# Altium project FMC_Delay_1ns_4Cha.PrjPcb (part 2 of 2)

## Sheet TDC.SchDoc: TDC
size 420 x 297 mm; CheckedBy: -; CompanyName: CERN; DrawnBy: GK; Organization: CERN; Address1: European Organization for Nuclear Research; Address2: CH-1211 Genève 23 - Switzerland; Revision: -; SheetNumber: 7; SheetTotal: 9; EDA_Number: EDA-XXXXX-VX-X; Projet: FMC Delay 1ns 4cha; ModifiedBy: -; CreateDate: XX/XX/XXXX; CheckedDate: -; Title2: Title2; DivGrp: BE-CO; Designer: GK; ModifiedDate: -
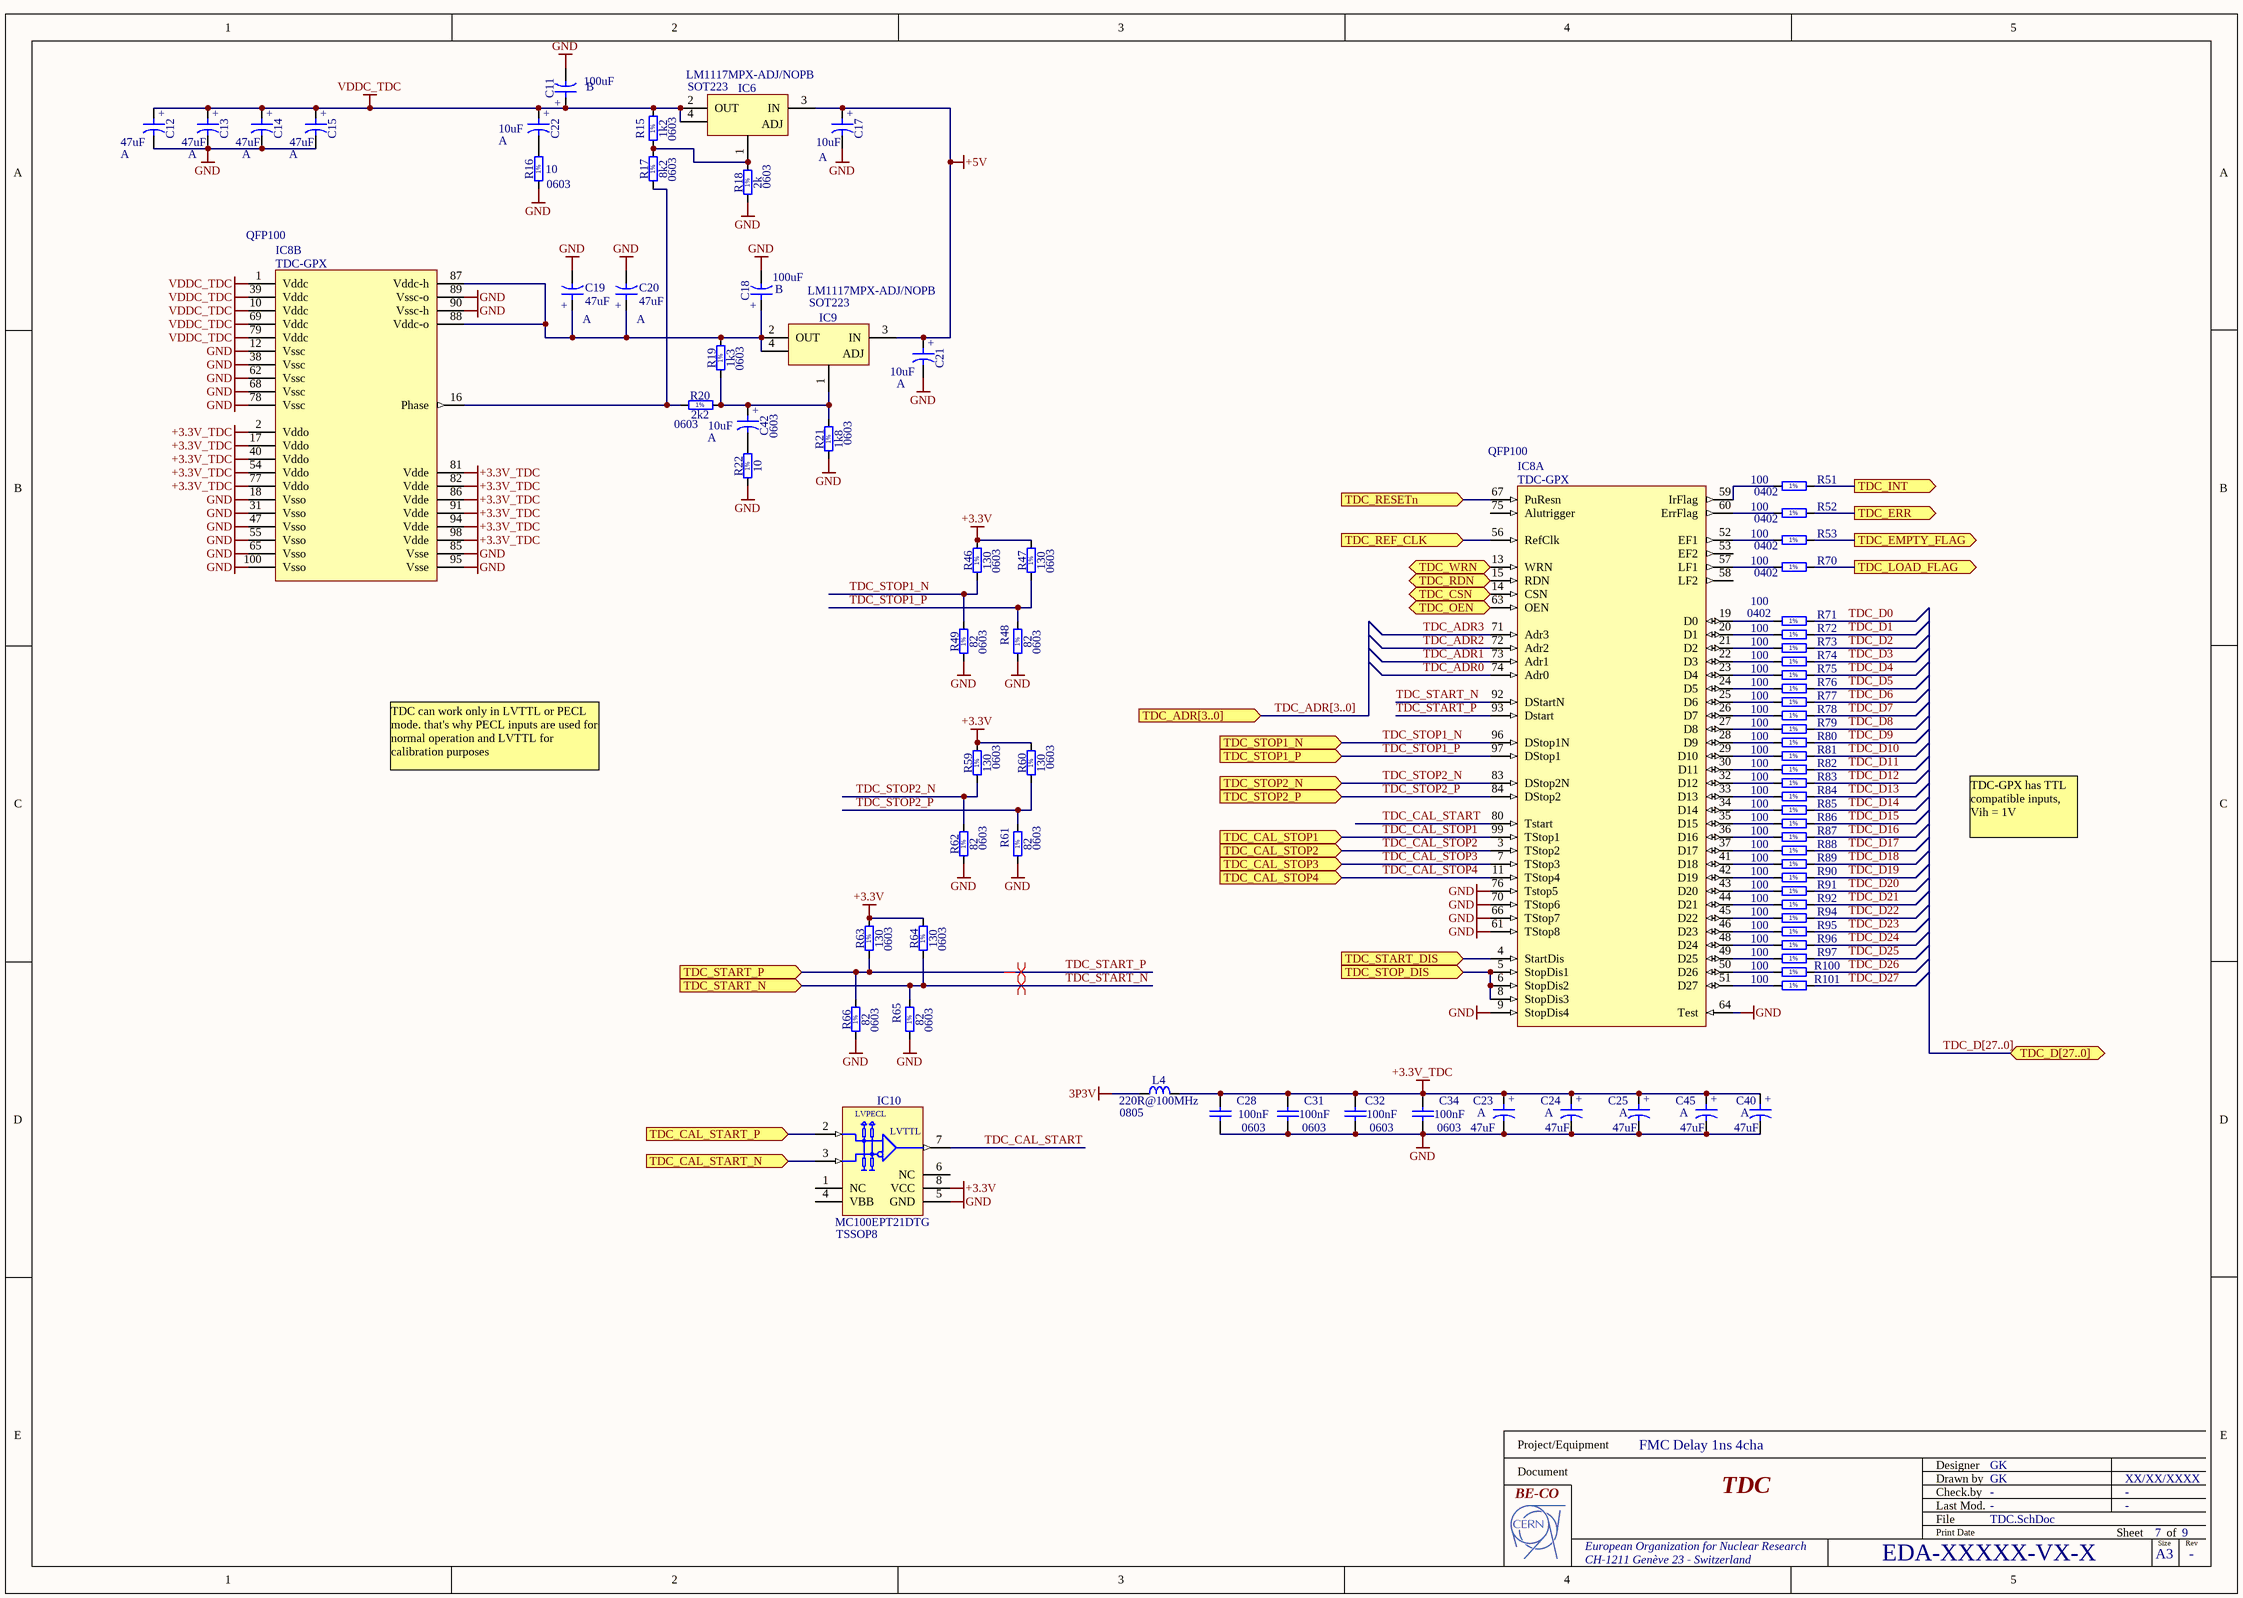
[diagram p3: TDC.SchDoc]

### Parts
C11  100uF  Case: B  [CAPMP3528X210N]
C12  47uF  Case: A  [CAPMP3216X180N]
C13  47uF  Case: A  [CAPMP3216X180N]
C14  47uF  Case: A  [CAPMP3216X180N]
C15  47uF  Case: A  [CAPMP3216X180N]
C17  10uF  Case: A  [CAPMP3216X180N]
C18  100uF  Case: B  [CAPMP3528X210N]
C19  47uF  Case: A  [CAPMP3216X180N]
C20  47uF  Case: A  [CAPMP3216X180N]
C21  10uF  Case: A  [CAPMP3216X180N]
C22  10uF  Case: A  [CAPMP3216X180N]
C23  47uF  Case: A  [CAPMP3216X180N]
C24  47uF  Case: A  [CAPMP3216X180N]
C25  47uF  Case: A  [CAPMP3216X180N]
C28  100nF  Case: 0603  [CAPC1608X87N]
C31  100nF  Case: 0603  [CAPC1608X87N]
C32  100nF  Case: 0603  [CAPC1608X87N]
C34  100nF  Case: 0603  [CAPC1608X87N]
C40  47uF  Case: A  [CAPMP3216X180N]
C42  10uF  Case: A  [CAPMP3216X180N]
C45  47uF  Case: A  [CAPMP3216X180N]
IC6  LM1117MPX-ADJ/NOPB  Case: SOT223  [SOT230P700X180-4N]
IC8  TDC-GPX  Case: QFP100  [QFP50P1600X1600X120-100N]  (parts A,B of 2)
IC9  LM1117MPX-ADJ/NOPB  Case: SOT223  [SOT230P700X180-4N]
IC10  MC100EPT21DTG  Case: TSSOP8  [SOP65P490X110-8N]
L4  220R@100MHz  Case: 0805  [INDC2012X105N]
R15  1k2  Case: 0603  [RESC1608X55N]
R16  10  Case: 0603  [RESC1608X55N]
R17  8k2  Case: 0603  [RESC1608X55N]
R18  2k  Case: 0603  [RESC1608X55N]
R19  1k3  Case: 0603  [RESC1608X55N]
R20  2k2  Case: 0603  [RESC1608X55N]
R21  1k8  Case: 0603  [RESC1608X55N]
R22  10  Case: 0603  [RESC1608X55N]
R46  130  Case: 0603  [RESC1608X55N]
R47  130  Case: 0603  [RESC1608X55N]
R48  82  Case: 0603  [RESC1608X55N]
R49  82  Case: 0603  [RESC1608X55N]
R51  100  Case: 0402  [RESC1005X40N]
R52  100  Case: 0402  [RESC1005X40N]
R53  100  Case: 0402  [RESC1005X40N]
R59  130  Case: 0603  [RESC1608X55N]
R60  130  Case: 0603  [RESC1608X55N]
R61  82  Case: 0603  [RESC1608X55N]
R62  82  Case: 0603  [RESC1608X55N]
R63  130  Case: 0603  [RESC1608X55N]
R64  130  Case: 0603  [RESC1608X55N]
R65  82  Case: 0603  [RESC1608X55N]
R66  82  Case: 0603  [RESC1608X55N]
R70  100  Case: 0402  [RESC1005X40N]
R71  100  Case: 0402  [RESC1005X40N]
R72  100  [RESC1005X40N]
R73  100  [RESC1005X40N]
R74  100  [RESC1005X40N]
R75  100  [RESC1005X40N]
R76  100  [RESC1005X40N]
R77  100  [RESC1005X40N]
R78  100  [RESC1005X40N]
R79  100  [RESC1005X40N]
R80  100  [RESC1005X40N]
R81  100  [RESC1005X40N]
R82  100  [RESC1005X40N]
R83  100  [RESC1005X40N]
R84  100  [RESC1005X40N]
R85  100  [RESC1005X40N]
R86  100  [RESC1005X40N]
R87  100  [RESC1005X40N]
R88  100  [RESC1005X40N]
R89  100  [RESC1005X40N]
R90  100  [RESC1005X40N]
R91  100  [RESC1005X40N]
R92  100  [RESC1005X40N]
R94  100  [RESC1005X40N]
R95  100  [RESC1005X40N]
R96  100  [RESC1005X40N]
R97  100  [RESC1005X40N]
R100  100  [RESC1005X40N]
R101  100  [RESC1005X40N]

### Ports
TDC_ADR[3..0] (in), TDC_CAL_START_N (in), TDC_CAL_START_P (in), TDC_CAL_STOP1 (in), TDC_CAL_STOP2 (in), TDC_CAL_STOP3 (in), TDC_CAL_STOP4 (in), TDC_CSN (in), TDC_D[27..0] (bidir), TDC_EMPTY_FLAG (out), TDC_ERR (out), TDC_INT (out), TDC_LOAD_FLAG (out), TDC_OEN (in), TDC_RDN (in), TDC_REF_CLK (in), TDC_RESETn (in), TDC_START_DIS (in), TDC_START_N (in), TDC_START_P (in), TDC_STOP1_N (in), TDC_STOP1_P (in), TDC_STOP2_N (in), TDC_STOP2_P (in), TDC_STOP_DIS (in), TDC_WRN (in)

### Nets
+3.3V: IC10.8(VCC) L4.1 R46.2 R47.2 R59.2 R60.2 R63.2 R64.2  [also labelled 3P3V]
+3.3V_TDC: C23.1 C24.1 C25.1 C28.1 C31.1 C32.1 C34.1 C40.1 C45.1 IC8.2(Vddo) IC8.17(Vddo) IC8.40(Vddo) IC8.54(Vddo) IC8.77(Vddo) IC8.81(Vdde) IC8.82(Vdde) IC8.86(Vdde) IC8.91(Vdde) IC8.94(Vdde) IC8.98(Vdde) L4.2
+5V: C17.1 C21.1 IC6.3(IN) IC9.3(IN)
GND: C11.2 C12.2 C13.2 C14.2 C15.2 C17.2 C18.2 C19.2 C20.2 C21.2 C23.2 C24.2 C25.2 C28.2 C31.2 C32.2 C34.2 C40.2 C45.2 IC8.9(StopDis4) IC8.12(Vssc) IC8.18(Vsso) IC8.31(Vsso) IC8.38(Vssc) IC8.47(Vsso) IC8.55(Vsso) IC8.61(TStop8) IC8.62(Vssc) IC8.64(Test) IC8.65(Vsso) IC8.66(TStop7) IC8.68(Vssc) IC8.70(TStop6) IC8.76(Tstop5) IC8.78(Vssc) IC8.85(Vsse) IC8.89(Vssc-o) IC8.90(Vssc-h) IC8.95(Vsse) IC8.100(Vsso) IC10.5(GND) R16.1 R18.1 R21.1 R22.1 R48.1 R49.1 R61.1 R62.1 R65.1 R66.1
VDDC_TDC: C11.1 C12.1 C13.1 C14.1 C15.1 C22.1 IC6.2(OUT) IC6.4(OUT) IC8.1(Vddc) IC8.10(Vddc) IC8.39(Vddc) IC8.69(Vddc) IC8.79(Vddc) R15.2
TDC_ADR0: IC8.74(Adr0)
TDC_ADR1: IC8.73(Adr1)
TDC_ADR2: IC8.72(Adr2)
TDC_ADR3: IC8.71(Adr3)
TDC_CAL_START: IC8.80(Tstart) IC10.7(Q0)
TDC_CAL_STOP1: IC8.99(TStop1) ; port TDC_CAL_STOP1
TDC_CAL_STOP2: IC8.3(TStop2) ; port TDC_CAL_STOP2
TDC_CAL_STOP3: IC8.7(TStop3) ; port TDC_CAL_STOP3
TDC_CAL_STOP4: IC8.11(TStop4) ; port TDC_CAL_STOP4
TDC_D0: R71.2
TDC_D1: R72.2
TDC_D2: R73.2
TDC_D3: R74.2
TDC_D4: R75.2
TDC_D5: R76.2
TDC_D6: R77.2
TDC_D7: R78.2
TDC_D8: R79.2
TDC_D9: R80.2
TDC_D10: R81.2
TDC_D11: R82.2
TDC_D12: R83.2
TDC_D13: R84.2
TDC_D14: R85.2
TDC_D15: R86.2
TDC_D16: R87.2
TDC_D17: R88.2
TDC_D18: R89.2
TDC_D19: R90.2
TDC_D20: R91.2
TDC_D21: R92.2
TDC_D22: R94.2
TDC_D23: R95.2
TDC_D24: R96.2
TDC_D25: R97.2
TDC_D26: R100.2
TDC_D27: R101.2
TDC_START_N: IC8.92(DStartN) R64.1 R65.2 ; port TDC_START_N
TDC_START_P: IC8.93(Dstart) R63.1 R66.2 ; port TDC_START_P
TDC_STOP1_N: IC8.96(DStop1N) R46.1 R49.2 ; port TDC_STOP1_N
TDC_STOP1_P: IC8.97(DStop1) R47.1 R48.2 ; port TDC_STOP1_P
TDC_STOP2_N: IC8.83(DStop2N) R59.1 R62.2 ; port TDC_STOP2_N
TDC_STOP2_P: IC8.84(DStop2) R60.1 R61.2 ; port TDC_STOP2_P
NetC18_1: C18.1 C19.1 C20.1 IC8.87(Vddc-h) IC8.88(Vddc-o) IC9.2(OUT) IC9.4(OUT) R19.2
NetC22_2: C22.2 R16.2
NetC42_1: C42.1 IC9.1(ADJ) R19.1 R20.2 R21.2
NetC42_2: C42.2 R22.2
NetIC2B_4: IC10.2(D0) ; port TDC_CAL_START_P
NetIC2B_5: IC10.3(~{D0}) ; port TDC_CAL_START_N
NetIC4_35: IC8.56(RefClk) ; port TDC_REF_CLK
NetIC6_1: IC6.1(ADJ) R15.1 R17.2 R18.2
NetIC8_4: IC8.4(StartDis) ; port TDC_START_DIS
NetIC8_5: IC8.5(StopDis1) IC8.6(StopDis2) IC8.8(StopDis3) ; port TDC_STOP_DIS
NetIC8_13: IC8.13(WRN) ; port TDC_WRN
NetIC8_14: IC8.14(CSN) ; port TDC_CSN
NetIC8_15: IC8.15(RDN) ; port TDC_RDN
NetIC8_16: IC8.16(Phase) R17.1 R20.1
NetIC8_19: IC8.19(D0) R71.1
NetIC8_20: IC8.20(D1) R72.1
NetIC8_21: IC8.21(D2) R73.1
NetIC8_22: IC8.22(D3) R74.1
NetIC8_23: IC8.23(D4) R75.1
NetIC8_24: IC8.24(D5) R76.1
NetIC8_25: IC8.25(D6) R77.1
NetIC8_26: IC8.26(D7) R78.1
NetIC8_27: IC8.27(D8) R79.1
NetIC8_28: IC8.28(D9) R80.1
NetIC8_29: IC8.29(D10) R81.1
NetIC8_30: IC8.30(D11) R82.1
NetIC8_32: IC8.32(D12) R83.1
NetIC8_33: IC8.33(D13) R84.1
NetIC8_34: IC8.34(D14) R85.1
NetIC8_35: IC8.35(D15) R86.1
NetIC8_36: IC8.36(D16) R87.1
NetIC8_37: IC8.37(D17) R88.1
NetIC8_41: IC8.41(D18) R89.1
NetIC8_42: IC8.42(D19) R90.1
NetIC8_43: IC8.43(D20) R91.1
NetIC8_44: IC8.44(D21) R92.1
NetIC8_45: IC8.45(D22) R94.1
NetIC8_46: IC8.46(D23) R95.1
NetIC8_48: IC8.48(D24) R96.1
NetIC8_49: IC8.49(D25) R97.1
NetIC8_50: IC8.50(D26) R100.1
NetIC8_51: IC8.51(D27) R101.1
NetIC8_52: IC8.52(EF1) R53.1
NetIC8_57: IC8.57(LF1) R70.1
NetIC8_59: IC8.59(IrFlag) R51.1
NetIC8_60: IC8.60(ErrFlag) R52.1
NetIC8_63: IC8.63(OEN) ; port TDC_OEN
NetIC8_67: IC8.67(PuResn) ; port TDC_RESETn
NetJ6_h26: R70.2 ; port TDC_LOAD_FLAG
NetJ6_h28: R53.2 ; port TDC_EMPTY_FLAG
NetJ6_h31: R51.2 ; port TDC_INT
NetJ6_h32: R52.2 ; port TDC_ERR

Not connected (* = marked no-connect by the designer): IC8 53(EF2) 58(LF2) 75(Alutrigger); IC10 1(NC) 4(VBB) 6(NC)

### Buses and harness runs
bus TDC_ADR[3..0] = port TDC_ADR[3..0]
bus TDC_D[27..0] = port TDC_D[27..0]

### Layout directives
differential pair: TDC_START_N, TDC_START_P

### Notes on the sheet
- TDC can work only in LVTTL or PECL mode. that's why PECL inputs are used for normal operation and LVTTL for calibration purposes
- TDC-GPX has TTL compatible inputs, Vih = 1V
- Project/Equipment
- Document
- TDC
- Designer
- Drawn by
- Check.by
- File
- Last Mod.
- Print Date
- Sheet
- Size
- A3
- of
- Rev
- (in symbol CTE3216-18_10UF_10V_10%_LESR1800) +
- (in symbol CTE3216-18_47UF_2.5V_10%) +
- (in symbol CTE3528-21_100UF_6.3V_10%) +
- (in symbol MC100EPT21DTG) LVPECL; LVTTL
- (in symbol R0402_100R_1%_0.0625W_100PPM) 1%
- (in symbol R0603_1K2_1%_0.1W_100PPM) 1%
- (in symbol R0603_1K3_1%_0.1W_100PPM) 1%
- (in symbol R0603_1K8_1%_0.1W_100PPM) 1%
- (in symbol R0603_2K2_1%_0.1W_100PPM) 1%
- (in symbol R0603_2K_1%_0.1W_100PPM) 1%
- (in symbol R0603_8K2_1%_0.1W_100PPM) 1%
- (in symbol R0603_10R_1%_0.1W_200PPM) 1%
- (in symbol R0603_82R_1%_0.1W_100PPM) 1%
- (in symbol R0603_130R_1%_0.1W_100PPM) 1%

### Library data of the parts
C11 C18 = CTE3528-21_100UF_6.3V_10%: Polarised capacitor; Part Description: Solid Tantalum Chip Capacitor; Manufacturer: GENERIC; Manufacturer1 Part Number: TAJB107K006R; Voltage: 6.3V; Tolerance: ±10%; Table: Capacitors SMD; Part Number: CTE3528-21_100UF_6.3V_10%; Component Kind: Standard; Component Type: Standard; Pin Count: 2; Value: 100uF; Status: Preferred; Manufacturer Part Number: CTE3528-21_100UF_6.3V_10%; Mounted: Yes; Socket: No; SMD: Yes; Manufacturer1 Example: AVX; Manufacturer1 ComponentHeight: 2.1mm; HelpURL: \\cern.ch\dfs\Applications\Altium\Datasheets\CTE_AVX_TAJ.pdf; Author: CERN DEM JLC; CreateDate: 2007-12-03; LatestRevisionDate: 2007-12-03
C12-C15 C19 C20 C23-C25 C40 C45 = CTE3216-18_47UF_2.5V_10%: Polarised capacitor; Part Description: Solid Tantalum Chip Capacitor; Manufacturer: GENERIC; Manufacturer1 Part Number: TAJA476K002R; Voltage: 2.5V; Tolerance: ±10%; Table: Capacitors SMD; Part Number: CTE3216-18_47UF_2.5V_10%; Component Kind: Standard; Component Type: Standard; Pin Count: 2; Value: 47uF; Status: Preferred; Manufacturer Part Number: CTE3216-18_47UF_2.5V_10%; Mounted: Yes; Socket: No; SMD: Yes; Manufacturer1 Example: AVX; Manufacturer1 ComponentHeight: 1.8mm; HelpURL: \\cern.ch\dfs\Applications\Altium\Datasheets\CTE_AVX_TAJ.pdf; Author: CERN DEM JLC; CreateDate: 2007-12-03; LatestRevisionDate: 2007-12-03
C17 C21 C22 C42 = CTE3216-18_10UF_10V_10%_LESR1800: Polarised capacitor; Part Description: Low ESR 1R8 Solid Tantalum Chip Capacitor; Manufacturer: GENERIC; Manufacturer1 Part Number: TPSA106K010R1800; Voltage: 10V; Tolerance: ±10%; Table: Capacitors SMD; Part Number: CTE3216-18_10UF_10V_10%_LESR1800; Component Kind: Standard; Component Type: Standard; Pin Count: 2; Value: 10uF; Status: Preferred; Manufacturer Part Number: CTE3216-18_10UF_10V_10%_LESR1800; Mounted: Yes; Socket: No; SMD: Yes; Manufacturer1 Example: AVX; Manufacturer1 ComponentHeight: 1.8mm; HelpURL: \\cern.ch\dfs\Applications\Altium\Datasheets\CTE-LESR_AVX_TPS.pdf; Author: CERN DEM JLC; CreateDate: 2008-05-05; LatestRevisionDate: 2009-01-20
C28 C31 C32 C34 = CC0603_100NF_50V_10%_X7R: Non-polarised capacitor; Manufacturer1 Part Number: 223858615649; Manufacturer: GENERIC; Part Description: SMD Multilayer Chip Ceramic Capacitor; Table: Capacitors SMD; TC: X7R; Tolerance: ±10%; Voltage: 50V; Author: CERN DEM JLC; Component Type: Standard; CreateDate: 03.12.2007; HelpURL: \\cern.ch\dfs\Applications\Altium\Datasheets\CC0603_X7R_PHYCOMP.pdf; LatestRevisionDate: 03.12.2007; Manufacturer1 ComponentHeight: 0.87mm; Manufacturer1 Example: PHYCOMP; Manufacturer Part Number: CC0603_100NF_50V_10%_X7R; Mounted: Yes; Pin Count: 2; SMD: Yes; Socket: No; Status: Preferred; Value: 100nF; Part Number: CC0603_100NF_50V_10%_X7R; Component Kind: Standard
IC6 IC9 = LM1117MPX-ADJ/NOPB: 3-Terminal Regulator 1=Adj 2=OUT 3=INt 4=OUT; Part Description: 1.25V to 13.8V, 800mA, Adjustable Low-Dropout Linear Regulator; Manufacturer: NATIONAL SEMICONDUCTOR; Table: Regulators; Part Number: LM1117MPX-ADJ/NOPB; Component Kind: Standard; Component Type: Standard; Device: LM1117MPX-ADJ/NOPB; PackageDescription: SOT223, 2.30mm pitch; 3 pin, 3.70mm W X 6.70mm L, IPC Medium Density; Manufacturer Part Number: LM1117MPX-ADJ/NOPB; Pin Count: 4; Mounted: Yes; Socket: No; SMD: Yes; ComponentHeight: 1.8mm; HelpURL: \\cern.ch\dfs\Applications\Altium\Datasheets\LM1117MPX-ADJ-NOPB.pdf; Author: CERN DEM JLC; CreateDate: 2010-07-05; LatestRevisionDate: 2010-07-05
IC8 = TDC-GPX: Multifunctional High-End Time-to-Digital Converter (4 different operation modes, 81 ps up to 10 ps resolution); Manufacturer: ACAM MESS-ELECTRONIC; Table: Analog & Interface; Part Number: TDC-GPX; Component Kind: Standard; Component Type: Standard; Device: TDC-GPX; PackageDescription: QFP,0.50mm pitch,square;100 pin,14.00mm L X 14.00mm W X 1.20mm H body (w/thermal tab), IPC Medium Density; Part Description: Multifunctional High-End Time-to-Digital Converter (4 different operation modes, 81 ps up to 10 ps resolution); Manufacturer Part Number: TDC-GPX; Pin Count: 100; Mounted: Yes; Socket: No; SMD: Yes; ComponentHeight: 1.2mm; Author: CERN DEM JLC; HelpURL: \\cern.ch\dfs\Applications\Altium\Datasheets\TDC-GPX.pdf; CreateDate: 2010-07-05; LatestRevisionDate: 2010-07-05
IC10 = MC100EPT21DTG: 3.3V Differential LVPECL/LVDS/CML  to LVTTL/LVCMOS Translator; Manufacturer: ON SEMICONDUCTOR; Table: Standard Logic; Part Number: MC100EPT21DTG; Component Kind: Standard; Component Type: Standard; Device: MC100EPT21DTG; PackageDescription: SOP, 0.65mm pitch; 8 pin, 3.00mm W X 3.00mm L X 1.10mm H body, IPC Medium Density; Part Description: 3.3V Differential LVPECL/LVDS/CML  to LVTTL/LVCMOS Translator; Manufacturer Part Number: MC100EPT21DTG; Pin Count: 8; Mounted: Yes; Socket: No; SMD: Yes; ComponentHeight: 1.1mm; Author: CERN DEM JLC; HelpURL: \\cern.ch\dfs\Applications\Altium\Datasheets\MC100EPT21DTG.pdf; CreateDate: 2010-07-06; LatestRevisionDate: 2010-07-06
L4 = IND0805_MURATA_BLM21PG221SN1D: Inductor; Part Description: SMD EMIFIL Suppression Chip Bead Ferrite; Manufacturer: MURATA; Power: 2A; Resistance: 0.05R; Tolerance: ±25%; Table: Inductors SMD; Part Number: IND0805_MURATA_BLM21PG221SN1D; Component Kind: Standard; Component Type: Standard; Pin Count: 2; Value: 220R@100MHz; Status: None; Manufacturer Part Number: BLM21PG221SN1D; Mounted: Yes; Socket: No; SMD: Yes; ComponentHeight: 1.05mm; HelpURL: \\cern.ch\dfs\Applications\Altium\Datasheets\IND0402_MURATA_BLM21P.pdf; Author: CERN DEM JLC; CreateDate: 2010-01-25; LatestRevisionDate: 2010-01-25
R15 = R0603_1K2_1%_0.1W_100PPM: Resistor - 1%; Part Description: General Purpose Thick Film Chip Resistor; Manufacturer: GENERIC; Manufacturer1 Part Number: NRC06F1201TRF; Power: 0.1W; TC: ±100ppm/°C; Table: Resistors SMD; Part Number: R0603_1K2_1%_0.1W_100PPM; Component Kind: Standard; Component Type: Standard; Pin Count: 2; Value: 1k2; Status: Preferred; Tolerance: ±1%; Manufacturer Part Number: R0603_1K2_1%_0.1W_100PPM; Mounted: Yes; Socket: No; SMD: Yes; Manufacturer1 Example: NIC COMPONENT; Manufacturer1 ComponentHeight: 0.55mm; HelpURL: \\cern.ch\dfs\Applications\Altium\Datasheets\R0603_NIC_NRC.pdf; Author: CERN DEM JLC; CreateDate: 2007-12-03; LatestRevisionDate: 2008-03-13
R16 R22 = R0603_10R_1%_0.1W_200PPM: Resistor - 1%; Part Description: General Purpose Thick Film Chip Resistor; Manufacturer: GENERIC; Manufacturer1 Part Number: NRC06F10R0TRF; Power: 0.1W; TC: ±200ppm/°C; Table: Resistors SMD; Part Number: R0603_10R_1%_0.1W_200PPM; Component Kind: Standard; Component Type: Standard; Pin Count: 2; Value: 10; Status: Preferred; Tolerance: ±1%; Manufacturer Part Number: R0603_10R_1%_0.1W_200PPM; Mounted: Yes; Socket: No; SMD: Yes; Manufacturer1 Example: NIC COMPONENT; Manufacturer1 ComponentHeight: 0.55mm; HelpURL: \\cern.ch\dfs\Applications\Altium\Datasheets\R0603_NIC_NRC.pdf; Author: CERN DEM JLC; CreateDate: 2007-12-03; LatestRevisionDate: 2009-06-24
R17 = R0603_8K2_1%_0.1W_100PPM: Resistor - 1%; Part Description: General Purpose Thick Film Chip Resistor; Manufacturer: GENERIC; Manufacturer1 Part Number: NRC06F8201TRF; Power: 0.1W; TC: ±100ppm/°C; Table: Resistors SMD; Part Number: R0603_8K2_1%_0.1W_100PPM; Component Kind: Standard; Component Type: Standard; Pin Count: 2; Value: 8k2; Status: Preferred; Tolerance: ±1%; Manufacturer Part Number: R0603_8K2_1%_0.1W_100PPM; Mounted: Yes; Socket: No; SMD: Yes; Manufacturer1 Example: NIC COMPONENT; Manufacturer1 ComponentHeight: 0.55mm; HelpURL: \\cern.ch\dfs\Applications\Altium\Datasheets\R0603_NIC_NRC.pdf; Author: CERN DEM JLC; CreateDate: 2007-12-03; LatestRevisionDate: 2008-03-13
R18 = R0603_2K_1%_0.1W_100PPM: Resistor - 1%; Part Description: General Purpose Thick Film Chip Resistor; Manufacturer: GENERIC; Manufacturer1 Part Number: NRC06F2001TRF; Power: 0.1W; TC: ±100ppm/°C; Table: Resistors SMD; Part Number: R0603_2K_1%_0.1W_100PPM; Component Kind: Standard; Component Type: Standard; Pin Count: 2; Value: 2k; Status: Preferred; Tolerance: ±1%; Manufacturer Part Number: R0603_2K_1%_0.1W_100PPM; Mounted: Yes; Socket: No; SMD: Yes; Manufacturer1 Example: NIC COMPONENT; Manufacturer1 ComponentHeight: 0.55mm; HelpURL: \\cern.ch\dfs\Applications\Altium\Datasheets\R0603_NIC_NRC.pdf; Author: CERN DEM JLC; CreateDate: 2007-12-03; LatestRevisionDate: 2008-03-13
R19 = R0603_1K3_1%_0.1W_100PPM: Resistor - 1%; Part Description: General Purpose Thick Film Chip Resistor; Manufacturer: GENERIC; Manufacturer1 Part Number: NRC06F1301TRF; Power: 0.1W; TC: ±100ppm/°C; Table: Resistors SMD; Part Number: R0603_1K3_1%_0.1W_100PPM; Component Kind: Standard; Component Type: Standard; Pin Count: 2; Value: 1k3; Status: Preferred; Tolerance: ±1%; Manufacturer Part Number: R0603_1K3_1%_0.1W_100PPM; Mounted: Yes; Socket: No; SMD: Yes; Manufacturer1 Example: NIC COMPONENT; Manufacturer1 ComponentHeight: 0.55mm; HelpURL: \\cern.ch\dfs\Applications\Altium\Datasheets\R0603_NIC_NRC.pdf; Author: CERN DEM JLC; CreateDate: 2007-12-03; LatestRevisionDate: 2008-03-13
R20 = R0603_2K2_1%_0.1W_100PPM: Resistor - 1%; Part Description: General Purpose Thick Film Chip Resistor; Manufacturer: GENERIC; Manufacturer1 Part Number: NRC06F2201TRF; Power: 0.1W; TC: ±100ppm/°C; Table: Resistors SMD; Part Number: R0603_2K2_1%_0.1W_100PPM; Component Kind: Standard; Component Type: Standard; Pin Count: 2; Value: 2k2; Status: Preferred; Tolerance: ±1%; Manufacturer Part Number: R0603_2K2_1%_0.1W_100PPM; Mounted: Yes; Socket: No; SMD: Yes; Manufacturer1 Example: NIC COMPONENT; Manufacturer1 ComponentHeight: 0.55mm; HelpURL: \\cern.ch\dfs\Applications\Altium\Datasheets\R0603_NIC_NRC.pdf; Author: CERN DEM JLC; CreateDate: 2007-12-03; LatestRevisionDate: 2008-03-13
R21 = R0603_1K8_1%_0.1W_100PPM: Resistor - 1%; Part Description: General Purpose Thick Film Chip Resistor; Manufacturer: GENERIC; Manufacturer1 Part Number: NRC06F1801TRF; Power: 0.1W; TC: ±100ppm/°C; Table: Resistors SMD; Part Number: R0603_1K8_1%_0.1W_100PPM; Component Kind: Standard; Component Type: Standard; Pin Count: 2; Value: 1k8; Status: Preferred; Tolerance: ±1%; Manufacturer Part Number: R0603_1K8_1%_0.1W_100PPM; Mounted: Yes; Socket: No; SMD: Yes; Manufacturer1 Example: NIC COMPONENT; Manufacturer1 ComponentHeight: 0.55mm; HelpURL: \\cern.ch\dfs\Applications\Altium\Datasheets\R0603_NIC_NRC.pdf; Author: CERN DEM JLC; CreateDate: 2007-12-03; LatestRevisionDate: 2008-03-13
R46 R47 R59 R60 R63 R64 = R0603_130R_1%_0.1W_100PPM: Resistor - 1%; Part Description: General Purpose Thick Film Chip Resistor; Manufacturer: GENERIC; Manufacturer1 Part Number: NRC06F1300TRF; Power: 0.1W; TC: ±100ppm/°C; Table: Resistors SMD; Part Number: R0603_130R_1%_0.1W_100PPM; Component Kind: Standard; Component Type: Standard; Pin Count: 2; Value: 130; Status: Preferred; Tolerance: ±1%; Manufacturer Part Number: R0603_130R_1%_0.1W_100PPM; Mounted: Yes; Socket: No; SMD: Yes; Manufacturer1 Example: NIC COMPONENT; Manufacturer1 ComponentHeight: 0.55mm; HelpURL: \\cern.ch\dfs\Applications\Altium\Datasheets\R0603_NIC_NRC.pdf; Author: CERN DEM JLC; CreateDate: 2007-12-03; LatestRevisionDate: 2008-03-13
R48 R49 R61 R62 R65 R66 = R0603_82R_1%_0.1W_100PPM: Resistor - 1%; Part Description: General Purpose Thick Film Chip Resistor; Manufacturer: GENERIC; Manufacturer1 Part Number: NRC06F82R0TRF; Power: 0.1W; TC: ±100ppm/°C; Table: Resistors SMD; Part Number: R0603_82R_1%_0.1W_100PPM; Component Kind: Standard; Component Type: Standard; Pin Count: 2; Value: 82; Status: Preferred; Tolerance: ±1%; Manufacturer Part Number: R0603_82R_1%_0.1W_100PPM; Mounted: Yes; Socket: No; SMD: Yes; Manufacturer1 Example: NIC COMPONENT; Manufacturer1 ComponentHeight: 0.55mm; HelpURL: \\cern.ch\dfs\Applications\Altium\Datasheets\R0603_NIC_NRC.pdf; Author: CERN DEM JLC; CreateDate: 2007-12-03; LatestRevisionDate: 2008-03-13
R51-R53 R70-R92 R94-R97 R100 R101 = R0402_100R_1%_0.0625W_100PPM: Resistor - 1%; Part Description: General Purpose Thick Film Chip Resistor; Manufacturer: GENERIC; Manufacturer1 Part Number: 232270671001; TC: ±100ppm/°C; Table: Resistors SMD; Part Number: R0402_100R_1%_0.0625W_100PPM; Component Kind: Standard; Component Type: Standard; Pin Count: 2; Value: 100; Status: Not recommended; Power: 0.0625W; Tolerance: ±1%; Manufacturer Part Number: R0402_100R_1%_0.0625W_100PPM; Mounted: Yes; Socket: No; SMD: Yes; Manufacturer1 Example: PHYCOMP; Manufacturer1 ComponentHeight: 0.4mm; HelpURL: \\cern.ch\dfs\Applications\Altium\Datasheets\R0402_Phycomp_RC0402.pdf; Author: CERN DEM JLC; CreateDate: 2007-12-03; LatestRevisionDate: 2008-03-13
  R72-R92 R94-R97 R100 R101: Case: 0402

## Sheet CHANNEL_DELAY.SchDoc: Programmable delay
size 297 x 209 mm; CheckedBy: -; CompanyName: CERN; DrawnBy: GK; Organization: CERN; Address1: European Organization for Nuclear Research; Address2: CH-1211 Geneve 23 - Switzerland; Revision: -; SheetNumber: 8; SheetTotal: 9; EDA_Number: EDA-XXXXX-VX-X; Projet: FMC Delay 1ns 4cha; ModifiedBy: -; CreateDate: XX/XX/XXXX; CheckedDate: -; Title2: Title2; DivGrp: BE-CO; Designer: GK; ModifiedDate: -
Used 2 times, as channels U_CHANNEL_DELAY, U_CHANNEL_DELAY. Parts and nets are listed once, with the designators drawn on the sheet.
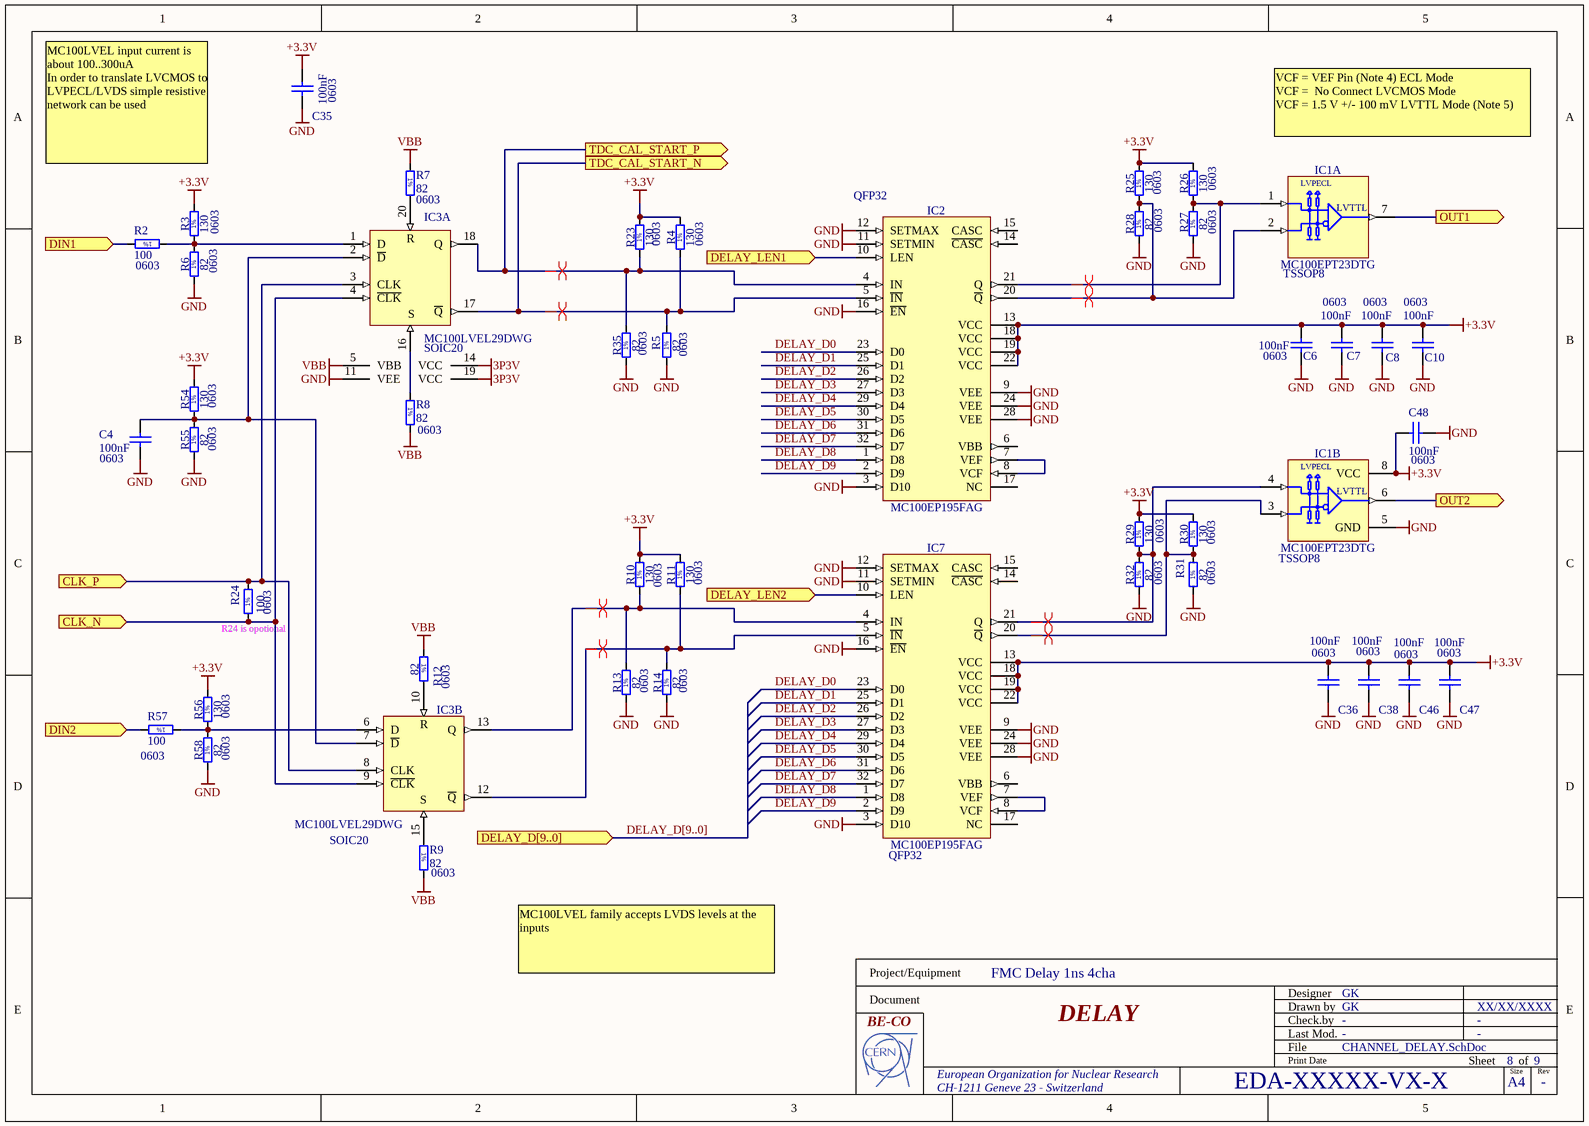
[diagram p4: CHANNEL_DELAY.SchDoc]

### Parts
C4  100nF  Case: 0603  [CAPC1608X87N]
C6  100nF  Case: 0603  [CAPC1608X87N]
C7  100nF  Case: 0603  [CAPC1608X87N]
C8  100nF  Case: 0603  [CAPC1608X87N]
C10  100nF  Case: 0603  [CAPC1608X87N]
C35  100nF  Case: 0603  [CAPC1608X87N]
C36  100nF  Case: 0603  [CAPC1608X87N]
C38  100nF  Case: 0603  [CAPC1608X87N]
C46  100nF  Case: 0603  [CAPC1608X87N]
C47  100nF  Case: 0603  [CAPC1608X87N]
C48  100nF  Case: 0603  [CAPC1608X87N]
IC1  MC100EPT23DTG  Case: TSSOP8  [SOP65P490X110-8N]  (parts A,B of 2)
IC2  MC100EP195FAG  Case: QFP32  [QFP80P900X900X160-32AN]
IC3  MC100LVEL29DWG  Case: SOIC20  [SOIC127P1030X265-20N]  (parts A,B of 2)
IC7  MC100EP195FAG  Case: QFP32  [QFP80P900X900X160-32AN]
R2  100  Case: 0603  [RESC1608X55N]
R3  130  Case: 0603  [RESC1608X55N]
R4  130  Case: 0603  [RESC1608X55N]
R5  82  Case: 0603  [RESC1608X55N]
R6  82  Case: 0603  [RESC1608X55N]
R7  82  Case: 0603  [RESC1608X55N]
R8  82  Case: 0603  [RESC1608X55N]
R9  82  Case: 0603  [RESC1608X55N]
R10  130  Case: 0603  [RESC1608X55N]
R11  130  Case: 0603  [RESC1608X55N]
R12  82  Case: 0603  [RESC1608X55N]
R13  82  Case: 0603  [RESC1608X55N]
R14  82  Case: 0603  [RESC1608X55N]
R23  130  Case: 0603  [RESC1608X55N]
R24  100  Case: 0603  [RESC1608X55N]
R25  130  Case: 0603  [RESC1608X55N]
R26  130  Case: 0603  [RESC1608X55N]
R27  82  Case: 0603  [RESC1608X55N]
R28  82  Case: 0603  [RESC1608X55N]
R29  130  Case: 0603  [RESC1608X55N]
R30  130  Case: 0603  [RESC1608X55N]
R31  82  Case: 0603  [RESC1608X55N]
R32  82  Case: 0603  [RESC1608X55N]
R35  82  Case: 0603  [RESC1608X55N]
R54  130  Case: 0603  [RESC1608X55N]
R55  82  Case: 0603  [RESC1608X55N]
R56  130  Case: 0603  [RESC1608X55N]
R57  100  Case: 0603  [RESC1608X55N]
R58  82  Case: 0603  [RESC1608X55N]

### Ports
CLK_N (in), CLK_P (in), DELAY_D[9..0] (in), DELAY_LEN1 (in), DELAY_LEN2 (in), DIN1 (in), DIN2 (in), OUT1 (out), OUT2 (out), TDC_CAL_START_N (out), TDC_CAL_START_P (out)

### Nets
+3.3V: C6.1 C7.1 C8.1 C10.1 C35.1 C36.1 C38.1 C46.1 C47.1 C48.1 IC1.8(VCC) IC2.13(VCC) IC2.18(VCC) IC2.19(VCC) IC2.22(VCC) IC3.14(VCC) IC3.19(VCC) IC7.13(VCC) IC7.18(VCC) IC7.19(VCC) IC7.22(VCC) R3.2 R4.2 R10.2 R11.2 R23.2 R25.2 R26.2 R29.2 R30.2 R54.2 R56.2  [also labelled 3P3V, VCC]
GND: C4.2 C6.2 C7.2 C8.2 C10.2 C35.2 C36.2 C38.2 C46.2 C47.2 C48.2 IC1.5(GND) IC2.3(D10) IC2.9(VEE) IC2.11(SETMIN) IC2.12(SETMAX) IC2.16(~{EN}) IC2.24(VEE) IC2.28(VEE) IC3.11(VEE) IC7.3(D10) IC7.9(VEE) IC7.11(SETMIN) IC7.12(SETMAX) IC7.16(~{EN}) IC7.24(VEE) IC7.28(VEE) R5.1 R6.1 R13.1 R14.1 R27.1 R28.1 R31.1 R32.1 R35.1 R55.1 R58.1  [also labelled VEE]
VBB: IC3.5(VBB) R7.1 R8.2 R9.2 R12.1
CLK_N: IC3.4(~{CLK}) IC3.9(~{CLK}) R24.1 ; port CLK_N
CLK_P: IC3.3(CLK) IC3.8(CLK) R24.2 ; port CLK_P
DELAY_D0: IC2.23(D0) IC7.23(D0)
DELAY_D1: IC2.25(D1) IC7.25(D1)
DELAY_D2: IC2.26(D2) IC7.26(D2)
DELAY_D3: IC2.27(D3) IC7.27(D3)
DELAY_D4: IC2.29(D4) IC7.29(D4)
DELAY_D5: IC2.30(D5) IC7.30(D5)
DELAY_D6: IC2.31(D6) IC7.31(D6)
DELAY_D7: IC2.32(D7) IC7.32(D7)
DELAY_D8: IC2.1(D8) IC7.1(D8)
DELAY_D9: IC2.2(D9) IC7.2(D9)
DELAY_LEN1: IC2.10(LEN) ; port DELAY_LEN1
DELAY_LEN2: IC7.10(LEN) ; port DELAY_LEN2
DIN1: R2.2 ; port DIN1
DIN2: R57.2 ; port DIN2
OUT1: IC1.7(Q0) ; port OUT1
OUT2: IC1.6(Q0) ; port OUT2
TDC_CAL_START_N: IC2.5(~{IN}) IC3.17(~{Q}) R4.1 R5.2 ; port TDC_CAL_START_N
TDC_CAL_START_P: IC2.4(IN) IC3.18(Q) R23.1 R35.2 ; port TDC_CAL_START_P
NetC4_1: C4.1 IC3.2(~{D}) IC3.7(~{D}) R54.1 R55.2
NetIC1_1: IC1.1(D0) IC2.21(Q) R26.1 R27.2
NetIC1_2: IC1.2(~{D0}) IC2.20(~{Q}) R25.1 R28.2
NetIC1_3: IC1.3(~{D0}) IC7.20(~{Q}) R30.1 R31.2
NetIC1_4: IC1.4(D0) IC7.21(Q) R29.1 R32.2
NetIC2_7: IC2.7(VEF) IC2.8(VCF)
NetIC3_1: IC3.1(D) R2.1 R3.1 R6.2
NetIC3_6: IC3.6(D) R56.1 R57.1 R58.2
NetIC3_10: IC3.10(R) R12.2
NetIC3_12: IC3.12(~{Q}) IC7.5(~{IN}) R11.1 R14.2
NetIC3_13: IC3.13(Q) IC7.4(IN) R10.1 R13.2
NetIC3_15: IC3.15(S) R9.1
NetIC3_16: IC3.16(S) R8.1
NetIC3_20: IC3.20(R) R7.2
NetIC7_7: IC7.7(VEF) IC7.8(VCF)

Not connected (* = marked no-connect by the designer): IC2 6(VBB) 14(~{CASC}) 15(CASC) 17(NC); IC7 6(VBB) 14(~{CASC}) 15(CASC) 17(NC)

### Channels
U_CHANNEL_DELAY: designators end in A; ports CLK_N=NetIC3A_4 CLK_P=NetIC3A_3 DELAY_LEN1=DELAY_LEN1 DELAY_LEN2=DELAY_LEN2 DIN1=DIN1 DIN2=DIN2 OUT1=NetIC1A_7 OUT2=NetIC1A_6 TDC_CAL_START_N=NetIC2A_5 TDC_CAL_START_P=NetIC2A_4
U_CHANNEL_DELAY: designators end in B; ports CLK_N=NetIC3A_4 CLK_P=NetIC3A_3 DELAY_LEN1=DELAY_LEN3 DELAY_LEN2=DELAY_LEN4 DIN1=DIN3 DIN2=DIN4 OUT1=NetIC1B_7 OUT2=NetIC1B_6 TDC_CAL_START_N=NetIC2B_5 TDC_CAL_START_P=NetIC2B_4

### Buses and harness runs
bus DELAY_D[9..0] = port DELAY_D[9..0]

### Layout directives
differential pair: NetIC1A_1, NetIC1A_2, NetIC1A_3, NetIC1A_4, NetIC2A_4, NetIC2A_5, NetIC3A_12, NetIC3A_13

### Notes on the sheet
- VCF = VEF Pin (Note 4) ECL Mode
  VCF =  No Connect LVCMOS Mode
  VCF = 1.5 V +/- 100 mV LVTTL Mode (Note 5)
- (near R3) MC100LVEL input current is about 100..300uA
  In order to translate LVCMOS to LVPECL/LVDS simple resistive network can be used
- (near R24) R24 is opotional
- MC100LVEL family accepts LVDS levels at the inputs
- Project/Equipment
- Document
- DELAY
- Designer
- Drawn by
- Check.by
- File
- Last Mod.
- Print Date
- Sheet
- Size
- A4
- of
- Rev
- (in symbol MC100EPT23DTG, part A) LVPECL; LVTTL
- (in symbol MC100EPT23DTG, part B) LVPECL; LVTTL
- (in symbol R0603_82R_1%_0.1W_100PPM) 1%
- (in symbol R0603_100R_1%_0.1W_100PPM) 1%
- (in symbol R0603_130R_1%_0.1W_100PPM) 1%

### Library data of the parts
C4 C6-C8 C10 C35 C36 C38 C46-C48 = CC0603_100NF_50V_10%_X7R: as C28 on sheet TDC; Author: CERN DEM JLC; Component Type: Standard; CreateDate: 03.12.2007; HelpURL: \\cern.ch\dfs\Applications\Altium\Datasheets\CC0603_X7R_PHYCOMP.pdf; LatestRevisionDate: 03.12.2007; Manufacturer1 ComponentHeight: 0.87mm; Manufacturer1 Example: PHYCOMP; Manufacturer Part Number: CC0603_100NF_50V_10%_X7R; Mounted: Yes; Pin Count: 2; SMD: Yes; Socket: No; Status: Preferred; Value: 100nF; Part Number: CC0603_100NF_50V_10%_X7R; Component Kind: Standard
IC1 = MC100EPT23DTG: 3.3V Dual Differential LVPECL/LVDS/CML  to LVTTL/LVCMOS Translator; Manufacturer: ON SEMICONDUCTOR; Table: Standard Logic; Part Number: MC100EPT23DTG; Component Kind: Standard; Component Type: Standard; Device: MC100EPT23DTG; PackageDescription: SOP, 0.65mm pitch; 8 pin, 3.00mm W X 3.00mm L X 1.10mm H body, IPC Medium Density; Part Description: 3.3V Dual Differential LVPECL/LVDS/CML  to LVTTL/LVCMOS Translator; Manufacturer Part Number: MC100EPT23DTG; Pin Count: 8; Mounted: Yes; Socket: No; SMD: Yes; ComponentHeight: 1.1mm; Author: CERN DEM JLC; HelpURL: \\cern.ch\dfs\Applications\Altium\Datasheets\MC100EPT23DTG.pdf; CreateDate: 2010-07-06; LatestRevisionDate: 2010-07-06
IC2 IC7 = MC100EP195FAG: 3.3V ECL Programmable Delay Chip; Part Number: MC100EP195BFAG; Manufacturer: ON SEMICONDUCTOR; Table: Standard Logic; Component Kind: Standard; Component Type: Standard; Device: MC100EP195FAG; PackageDescription: QFP,0.80mm Pitch, Square; 32 Pin, 7.00mm L X 7.00mm W X 1.60mm H Body, IPC Medium Density; Part Description: 3.3 V ECL Programmable Delay Chip; Manufacturer Part Number: MC100EP195FAG; Pin Count: 32; Mounted: Yes; Socket: No; SMD: Yes; ComponentHeight: 1.6mm; Author: CERN DEM JLC; HelpURL: \\cern.ch\dfs\Applications\Altium\Datasheets\MC100EP195FAG.pdf; CreateDate: 2010-04-15; LatestRevisionDate: 2010-04-15
IC3 = MC100LVEL29DWG: 3.3V ECL Dual Differential Data and Clock D Flip-Flop With Set and Reset; Manufacturer: ON SEMICONDUCTOR; Table: Standard Logic; Part Number: MC100LVEL29DWG; Component Kind: Standard; Component Type: Standard; Device: MC100LVEL29DWG; PackageDescription: SOIC 20, Pitch 1.27mm - Body 7.5x12.8mm, IPC Medium Density; Part Description: 3.3V ECL Dual Differential Data and Clock D Flip-Flop With Set and Reset; Manufacturer Part Number: MC100LVEL29DWG; Pin Count: 20; Mounted: Yes; Socket: No; SMD: Yes; ComponentHeight: 2.65mm; Author: CERN DEM JLC; HelpURL: \\cern.ch\dfs\Applications\Altium\Datasheets\MC100LVEL29DWG.pdf; CreateDate: 2010-07-06; LatestRevisionDate: 2010-07-06
R2 R24 R57 = R0603_100R_1%_0.1W_100PPM: Resistor - 1%; Part Description: General Purpose Thick Film Chip Resistor; Manufacturer: GENERIC; Manufacturer1 Part Number: NRC06F4700TRF; Power: 0.1W; TC: ±100ppm/°C; Table: Resistors SMD; Part Number: R0603_100R_1%_0.1W_100PPM; Component Kind: Standard; Component Type: Standard; Pin Count: 2; Value: 100; Status: Preferred; Tolerance: ±1%; Manufacturer Part Number: R0603_100R_1%_0.1W_100PPM; Mounted: Yes; Socket: No; SMD: Yes; Manufacturer1 Example: NIC COMPONENT; Manufacturer1 ComponentHeight: 0.55mm; HelpURL: \\cern.ch\dfs\Applications\Altium\Datasheets\R0603_NIC_NRC.pdf; Author: CERN DEM JLC; CreateDate: 2007-12-03; LatestRevisionDate: 2008-03-13
R3 R4 R10 R11 R23 R25 R26 R29 R30 R54 R56 = R0603_130R_1%_0.1W_100PPM: as R46 on sheet TDC; Part Number: R0603_130R_1%_0.1W_100PPM; Component Kind: Standard; Component Type: Standard; Pin Count: 2; Value: 130; Status: Preferred; Tolerance: ±1%; Manufacturer Part Number: R0603_130R_1%_0.1W_100PPM; Mounted: Yes; Socket: No; SMD: Yes; Manufacturer1 Example: NIC COMPONENT; Manufacturer1 ComponentHeight: 0.55mm; HelpURL: \\cern.ch\dfs\Applications\Altium\Datasheets\R0603_NIC_NRC.pdf; Author: CERN DEM JLC; CreateDate: 2007-12-03; LatestRevisionDate: 2008-03-13
R5-R9 R12-R14 R27 R28 R31 R32 R35 R55 R58 = R0603_82R_1%_0.1W_100PPM: as R48 on sheet TDC; Part Number: R0603_82R_1%_0.1W_100PPM; Component Kind: Standard; Component Type: Standard; Pin Count: 2; Value: 82; Status: Preferred; Tolerance: ±1%; Manufacturer Part Number: R0603_82R_1%_0.1W_100PPM; Mounted: Yes; Socket: No; SMD: Yes; Manufacturer1 Example: NIC COMPONENT; Manufacturer1 ComponentHeight: 0.55mm; HelpURL: \\cern.ch\dfs\Applications\Altium\Datasheets\R0603_NIC_NRC.pdf; Author: CERN DEM JLC; CreateDate: 2007-12-03; LatestRevisionDate: 2008-03-13

## Sheet INPUT_LOGIC.SchDoc: Input logic
size 297 x 209 mm; CheckedBy: -; CompanyName: CERN; Organization: CERN; Address1: European Organization for Nuclear Research; Address2: CH-1211 Geneve 23 - Switzerland; DocumentNumber: 5; Revision: -; SheetNumber: 6; SheetTotal: 9; EDA_Number: EDA-XXXXX-VX-X; Projet: FMC Delay 1ns 4cha; ModifiedBy: -; CheckedDate: -; Title2: -; DivGrp: BE-CO; Designer: GK; ModifiedDate: -
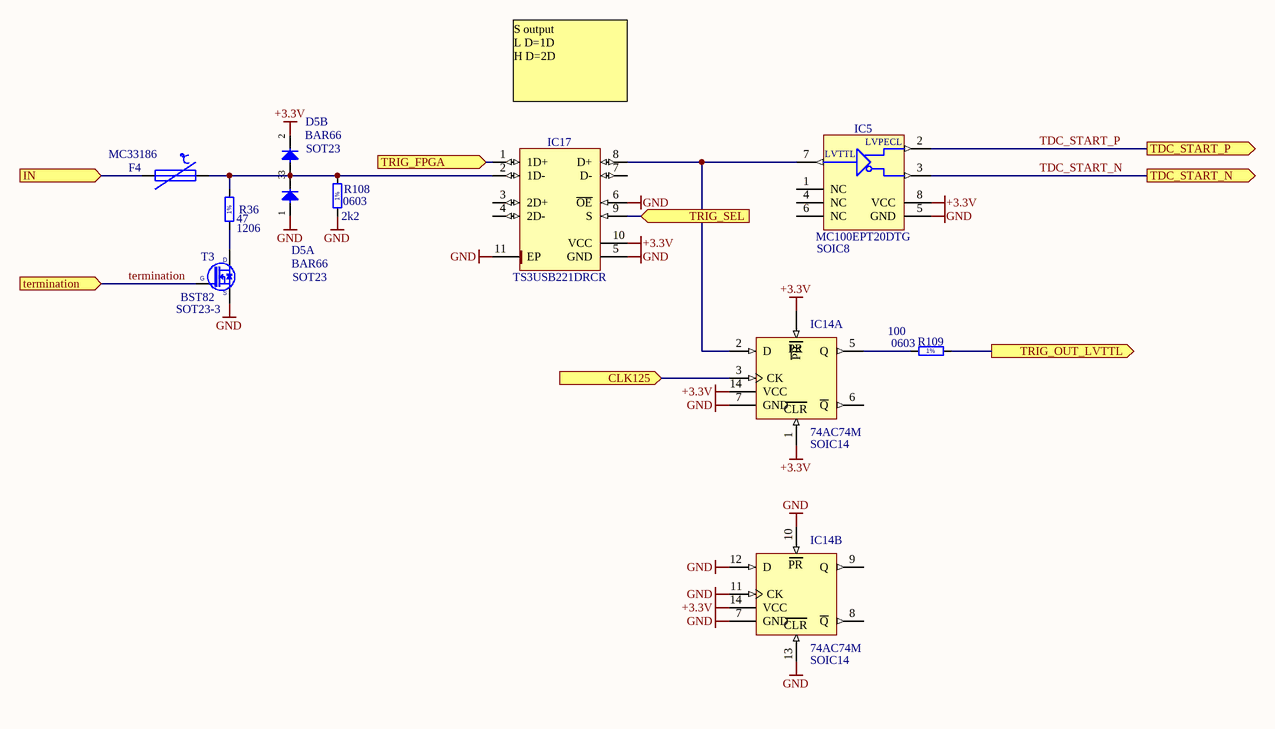
[diagram p5: INPUT_LOGIC.SchDoc]

### Parts
D5  BAR66  Case: SOT23  [SOT95P240X110-3N]  (parts A,B of 2)
F4  MC33186  [PTC_MC33186]
IC5  MC100EPT20DTG  Case: SOIC8  [SOP65P490X110-8N]
IC14  74AC74M  Case: SOIC14  [SOIC127P600X175-14N]  (parts A,B of 2)
IC17  TS3USB221DRCR  [SON50P300X300X100-11N-R175X250]
R36  47  Case: 1206  [RESC3216X65N]
R108  2k2  Case: 0603  [RESC1608X55N]
R109  100  Case: 0603  [RESC1608X55N]
T3  BST82  Case: SOT23-3  [SOT95P240X110-3N]

### Ports
CLK125 (in), IN (in), TDC_START_N (out), TDC_START_P (out), termination (in), TRIG_FPGA (in), TRIG_OUT_LVTTL (out), TRIG_SEL (in)

### Nets
+3.3V: D5.2(C) IC5.8(VCC) IC14.1(~{CLR}) IC14.4(~{PR}) IC14.14(VCC) IC17.10(VCC)  [also labelled VCC]
GND: D5.1(A) IC5.5(GND) IC14.7(GND) IC14.10(~{PR}) IC14.11(CK) IC14.12(D) IC14.13(~{CLR}) IC17.5(GND) IC17.6(~{OE}) IC17.11(EP) R108.1 T3.2(S)
TDC_START_N: IC5.3(~{Q}) ; port TDC_START_N
TDC_START_P: IC5.2(Q) ; port TDC_START_P
termination: T3.1(G) ; port termination
TRIG_OUT_LVTTL: R109.2 ; port TRIG_OUT_LVTTL
TRIG_SEL: IC17.9(S) ; port TRIG_SEL
NetD5_3: D5.3(COMAC) F4.2 IC17.2(1D-) R36.2 R108.2
NetF4_1: F4.1 ; port IN
NetIC4_33: IC14.3(CK) ; port CLK125
NetIC5_7: IC5.7(D) IC14.2(D) IC17.8(D+)
NetIC14_5: IC14.5(Q) R109.1
NetIC17_1: IC17.1(1D+) ; port TRIG_FPGA
NetR36_1: R36.1 T3.3(D)

Not connected (* = marked no-connect by the designer): IC5 1(NC) 4(NC) 6(NC); IC14 6(~{Q}) 8(~{Q}) 9(Q); IC17 3(2D+) 4(2D-) 7(D-)

### Notes on the sheet
- S	output
  L	D=1D
  H	D=2D
- Project/Equipment
- Document
- Designer
- Drawn by
- Check.by
- File
- Last Mod.
- Print Date
- Sheet
- Size
- A4
- of
- Rev
- (in symbol 74AC74M, part A) PR; CLR
- (in symbol 74AC74M, part B) PR; CLR
- (in symbol MC100EPT20DTG) LVPECL; LVTTL
- (in symbol R0603_2K2_1%_0.1W_100PPM) 1%
- (in symbol R0603_100R_1%_0.1W_100PPM) 1%
- (in symbol R1206_47R_1%_0.25W_100PPM) 1%

### Library data of the parts
D5 = BAR66: Serial Diode; Part Description: Silicon PIN Diode Array (Series Connected); Manufacturer: INFINEON; Manufacturer Part Number: BAT66; Voltage: 150V; Power: 250mA; Table: Diodes; Part Number: BAR66; Component Kind: Standard; Component Type: Standard; Device: BAR66; PackageDescription: SOT23 3-Leads, Pitch 0.95mm - Body 1.3x2.9mm, IPC Medium Density; Pin Count: 3; Mounted: Yes; Socket: No; SMD: Yes; ComponentHeight: 1.1mm; HelpURL: \\cern.ch\dfs\Applications\Altium\Datasheets\BAT66.pdf; Author: CERN DEM JLC; CreateDate: 18.01.2010; LatestRevisionDate: 18.01.2010
F4 = F_POLYSWITCH_0.1A: polymer FUSE Multicomp (Farnell)
IC5 = MC100EPT20DTG: 3.3V LVTTL/LVCMOS to Differential LVPECL Translator; Manufacturer: ON SEMICONDUCTOR; Table: Standard Logic; Part Number: MC100EPT20DTG; Component Kind: Standard; Component Type: Standard; Device: MC100EPT20DTG; PackageDescription: SOP, 0.65mm pitch; 8 pin, 3.00mm W X 3.00mm L X 1.10mm H body, IPC Medium Density; Part Description: 3.3V LVTTL/LVCMOS to Differential LVPECL Translator; Manufacturer Part Number: MC100EPT20DTG; Pin Count: 8; Mounted: Yes; Socket: No; SMD: Yes; ComponentHeight: 1.1mm; Author: CERN DEM JLC; HelpURL: \\cern.ch\dfs\Applications\Altium\Datasheets\MC100EPT20DTG.pdf; CreateDate: 2010-07-05; LatestRevisionDate: 2010-07-05
IC14 = 74AC74M: Dual D-Type Flip Flop with Preset and Clear; Manufacturer: ST MICROELECTRONICS; Table: Standard Logic; Part Number: 74AC74M; Component Kind: Standard; Component Type: Standard; Device: 74AC74M; PackageDescription: SOIC 14, Pitch 1.27mm - Body 4x8.75mm, IPC Medium Density; Part Description: Dual D-Type Flip Flop with Preset and Clear; Manufacturer Part Number: 74AC74M; Pin Count: 14; Mounted: Yes; Socket: No; SMD: Yes; ComponentHeight: 1.75mm; Author: CERN DEM JMW; HelpURL: \\cern.ch\dfs\Applications\Altium\Datasheets\74AC74M.pdf; CreateDate: 2008-11-21; LatestRevisionDate: 2008-11-21
IC17 = TS3USB221DRCR: High-Speed USB 2.0 (480-Mbps) 1:2 Multiplexer/Demultiplexer Switch With Single Enable; Manufacturer: TEXAS INSTRUMENTS; Table: Analog & Interface; Part Number: TS3USB221DRCR; Component Kind: Standard; Component Type: Standard; Device: TS3USB221DRCR; PackageDescription: SON, 0.50mm Pitch, 10-pin, 3.00mm W  X 3.00mm L X 1.00mm Height, (w/thermal tab 1.75 X 2.50 mm), IPC Medium Density; Part Description: High-Speed USB 2.0 (480-Mbps) 1:2 Multiplexer/Demultiplexer Switch With Single Enable; Manufacturer Part Number: TS3USB221DRCR; Pin Count: 11; Case: SON10; Mounted: Yes; Socket: No; SMD: Yes; ComponentHeight: 1mm; Author: CERN DEM JLC; HelpURL: \\cern.ch\dfs\Applications\Altium\Datasheets\TS3USB221DRCR.pdf; CreateDate: 2010-08-25; LatestRevisionDate: 2010-08-25
R36 = R1206_47R_1%_0.25W_100PPM: Resistor - 1%; Part Description: General Purpose Thick Film Chip Resistor; Manufacturer: GENERIC; Manufacturer1 Part Number: NRC12F47R0TRF; Power: 0.25W; TC: ±100ppm/°C; Table: Resistors SMD; Part Number: R1206_47R_1%_0.25W_100PPM; Component Kind: Standard; Component Type: Standard; Pin Count: 2; Value: 47; Status: Preferred; Tolerance: ±1%; Manufacturer Part Number: R1206_47R_1%_0.25W_100PPM; Mounted: Yes; Socket: No; SMD: Yes; Manufacturer1 Example: NIC COMPONENT; Manufacturer1 ComponentHeight: 0.65mm; HelpURL: \\cern.ch\dfs\Applications\Altium\Datasheets\R1206_NIC_NRC.pdf; Author: CERN DEM JLC; CreateDate: 2007-12-03; LatestRevisionDate: 2008-03-13
R108 = R0603_2K2_1%_0.1W_100PPM: as R20 on sheet TDC; Part Number: R0603_2K2_1%_0.1W_100PPM; Component Kind: Standard; Component Type: Standard; Pin Count: 2; Value: 2k2; Status: Preferred; Tolerance: ±1%; Manufacturer Part Number: R0603_2K2_1%_0.1W_100PPM; Mounted: Yes; Socket: No; SMD: Yes; Manufacturer1 Example: NIC COMPONENT; Manufacturer1 ComponentHeight: 0.55mm; HelpURL: \\cern.ch\dfs\Applications\Altium\Datasheets\R0603_NIC_NRC.pdf; Author: CERN DEM JLC; CreateDate: 2007-12-03; LatestRevisionDate: 2008-03-13
R109 = R0603_100R_1%_0.1W_100PPM: as R2 on sheet CHANNEL_DELAY; Part Number: R0603_100R_1%_0.1W_100PPM; Component Kind: Standard; Component Type: Standard; Pin Count: 2; Value: 100; Status: Preferred; Tolerance: ±1%; Manufacturer Part Number: R0603_100R_1%_0.1W_100PPM; Mounted: Yes; Socket: No; SMD: Yes; Manufacturer1 Example: NIC COMPONENT; Manufacturer1 ComponentHeight: 0.55mm; HelpURL: \\cern.ch\dfs\Applications\Altium\Datasheets\R0603_NIC_NRC.pdf; Author: CERN DEM JLC; CreateDate: 2007-12-03; LatestRevisionDate: 2008-03-13
T3 = BST82: N-CHANNEL MOSFET WITH DIODE; Part Description: 100V 190mA N-Channel Enhancement Mode Field-Effect Transistor; Manufacturer: NXP SEMICONDUCTORS; Table: Transistors; Part Number: BST82; Component Kind: Standard; Component Type: Standard; Device: BST82; PackageDescription: SOT23 3-Leads, Pitch 0.95mm - Body 1.4x3mm, IPC Medium Density; Manufacturer Part Number: BST82; Pin Count: 3; Mounted: Yes; Socket: No; SMD: Yes; ComponentHeight: 1.1mm; HelpURL: \\cern.ch\dfs\Applications\Altium\Datasheets\BST82.pdf; Author: CERN DEM JLC; CreateDate: 2008-05-14; LatestRevisionDate: 2008-05-14

## Nets that join several sheets
+3.3V: FMC_Delay_1ns_4Cha (SW1.3 SW1.4), clock_generator (L3.1 L17.2), FMC connector (J6.c39 J6.d36 J6.d38 J6.d40), TDC (8 pins), U_CHANNEL_DELAY (32 pins), U_CHANNEL_DELAY (32 pins), INPUT_LOGIC (6 pins)
GND: FMC_Delay_1ns_4Cha (7 pins), clock_generator (19 pins), FMC connector (68 pins), TDC (51 pins), U_CHANNEL_DELAY (38 pins), U_CHANNEL_DELAY (38 pins), INPUT_LOGIC (12 pins)
VBB: U_CHANNEL_DELAY (5 pins), U_CHANNEL_DELAY (5 pins)
CLK125_N: clock_generator (IC4.26 R233.1), FMC connector (J6.h5)
CLK125_P: clock_generator (IC4.25 R232.2), FMC connector (J6.h4)
DELAY_D0: FMC connector (J6.c10), U_CHANNEL_DELAY (IC2A.23 IC7A.23), U_CHANNEL_DELAY (IC2B.23 IC7B.23)
DELAY_D1: FMC connector (J6.c11), U_CHANNEL_DELAY (IC2A.25 IC7A.25), U_CHANNEL_DELAY (IC2B.25 IC7B.25)
DELAY_D2: FMC connector (J6.c14), U_CHANNEL_DELAY (IC2A.26 IC7A.26), U_CHANNEL_DELAY (IC2B.26 IC7B.26)
DELAY_D3: FMC connector (J6.c15), U_CHANNEL_DELAY (IC2A.27 IC7A.27), U_CHANNEL_DELAY (IC2B.27 IC7B.27)
DELAY_D4: FMC connector (J6.c18), U_CHANNEL_DELAY (IC2A.29 IC7A.29), U_CHANNEL_DELAY (IC2B.29 IC7B.29)
DELAY_D5: FMC connector (J6.c19), U_CHANNEL_DELAY (IC2A.30 IC7A.30), U_CHANNEL_DELAY (IC2B.30 IC7B.30)
DELAY_D6: FMC connector (J6.c22), U_CHANNEL_DELAY (IC2A.31 IC7A.31), U_CHANNEL_DELAY (IC2B.31 IC7B.31)
DELAY_D7: FMC connector (J6.c23), U_CHANNEL_DELAY (IC2A.32 IC7A.32), U_CHANNEL_DELAY (IC2B.32 IC7B.32)
DELAY_D8: FMC connector (J6.c26), U_CHANNEL_DELAY (IC2A.1 IC7A.1), U_CHANNEL_DELAY (IC2B.1 IC7B.1)
DELAY_D9: FMC connector (J6.c27), U_CHANNEL_DELAY (IC2A.2 IC7A.2), U_CHANNEL_DELAY (IC2B.2 IC7B.2)
DELAY_LEN1: FMC connector (J6.d23), U_CHANNEL_DELAY (IC2A.10)
DELAY_LEN2: FMC connector (J6.d24), U_CHANNEL_DELAY (IC7A.10)
DELAY_LEN3: FMC connector (J6.d27), U_CHANNEL_DELAY (IC2B.10)
DELAY_LEN4: FMC connector (J6.d26), U_CHANNEL_DELAY (IC7B.10)
DIN1: FMC connector (J6.d8), U_CHANNEL_DELAY (R2A.2)
DIN2: FMC connector (J6.d9), U_CHANNEL_DELAY (R57A.2)
DIN3: FMC connector (J6.d11), U_CHANNEL_DELAY (R2B.2)
DIN4: FMC connector (J6.d12), U_CHANNEL_DELAY (R57B.2)
EXT_CLK_N: clock_generator (IC4.14 R115.1), FMC connector (J6.c3)
EXT_CLK_P: clock_generator (IC4.13 R115.2), FMC connector (J6.c2)
NetF4_1: FMC_Delay_1ns_4Cha (J5.1), INPUT_LOGIC (F4.1)
NetIC2B_4: TDC (IC10.2), U_CHANNEL_DELAY (IC2B.4 IC3B.18 R23B.1 R35B.2)
NetIC2B_5: TDC (IC10.3), U_CHANNEL_DELAY (IC2B.5 IC3B.17 R4B.1 R5B.2)
NetIC3A_3: clock_generator (IC4.55), U_CHANNEL_DELAY (IC3A.3 IC3A.8 R24A.2), U_CHANNEL_DELAY (IC3B.3 IC3B.8 R24B.2)
NetIC3A_4: clock_generator (IC4.56), U_CHANNEL_DELAY (IC3A.4 IC3A.9 R24A.1), U_CHANNEL_DELAY (IC3B.4 IC3B.9 R24B.1)
NetIC4_16: clock_generator (IC4.16), FMC connector (J6.d20)
NetIC4_17: clock_generator (IC4.17), FMC connector (J6.d21)
NetIC4_22: clock_generator (IC4.22), FMC connector (J6.d17)
NetIC4_33: clock_generator (IC4.33), INPUT_LOGIC (IC14.3)
NetIC4_35: clock_generator (IC4.35), TDC (IC8.56)
NetIC4_36: clock_generator (IC4.36), FMC connector (J6.h16)
NetIC8_4: FMC connector (J6.h29), TDC (IC8.4)
NetIC8_5: FMC connector (J6.h25), TDC (IC8.5 IC8.6 IC8.8)
NetIC8_13: FMC connector (J6.h38), TDC (IC8.13)
NetIC8_14: FMC connector (J6.h35), TDC (IC8.14)
NetIC8_15: FMC connector (J6.h37), TDC (IC8.15)
NetIC8_63: FMC connector (J6.h34), TDC (IC8.63)
NetIC17_1: FMC connector (J6.d14), INPUT_LOGIC (IC17.1)
NetJ6_d18: clock_generator (R114.1), FMC connector (J6.d18)
NetJ6_h26: FMC connector (J6.h26), TDC (R70.2)
NetJ6_h28: FMC connector (J6.h28), TDC (R53.2)
NetJ6_h31: FMC connector (J6.h31), TDC (R51.2)
NetJ6_h32: FMC connector (J6.h32), TDC (R52.2)
TDC_ADR0: FMC connector (J6.h19), TDC (IC8.74)
TDC_ADR1: FMC connector (J6.h20), TDC (IC8.73)
TDC_ADR2: FMC connector (J6.h22), TDC (IC8.72)
TDC_ADR3: FMC connector (J6.h23), TDC (IC8.71)
TDC_D0: FMC connector (J6.g6), TDC (R71.2)
TDC_D1: FMC connector (J6.g7), TDC (R72.2)
TDC_D2: FMC connector (J6.g9), TDC (R73.2)
TDC_D3: FMC connector (J6.g10), TDC (R74.2)
TDC_D4: FMC connector (J6.g12), TDC (R75.2)
TDC_D5: FMC connector (J6.g13), TDC (R76.2)
TDC_D6: FMC connector (J6.g15), TDC (R77.2)
TDC_D7: FMC connector (J6.g16), TDC (R78.2)
TDC_D8: FMC connector (J6.g18), TDC (R79.2)
TDC_D9: FMC connector (J6.g19), TDC (R80.2)
TDC_D10: FMC connector (J6.g21), TDC (R81.2)
TDC_D11: FMC connector (J6.g22), TDC (R82.2)
TDC_D12: FMC connector (J6.g24), TDC (R83.2)
TDC_D13: FMC connector (J6.g25), TDC (R84.2)
TDC_D14: FMC connector (J6.g27), TDC (R85.2)
TDC_D15: FMC connector (J6.g28), TDC (R86.2)
TDC_D16: FMC connector (J6.g30), TDC (R87.2)
TDC_D17: FMC connector (J6.g31), TDC (R88.2)
TDC_D18: FMC connector (J6.g33), TDC (R89.2)
TDC_D19: FMC connector (J6.g34), TDC (R90.2)
TDC_D20: FMC connector (J6.g36), TDC (R91.2)
TDC_D21: FMC connector (J6.g37), TDC (R92.2)
TDC_D22: FMC connector (J6.h7), TDC (R94.2)
TDC_D23: FMC connector (J6.h8), TDC (R95.2)
TDC_D24: FMC connector (J6.h10), TDC (R96.2)
TDC_D25: FMC connector (J6.h11), TDC (R97.2)
TDC_D26: FMC connector (J6.h13), TDC (R100.2)
TDC_D27: FMC connector (J6.h14), TDC (R101.2)
TDC_START_N: TDC (IC8.92 R64.1 R65.2), INPUT_LOGIC (IC5.3)
TDC_START_P: TDC (IC8.93 R63.1 R66.2), INPUT_LOGIC (IC5.2)
TDC_STOP1_N: clock_generator (IC4.52), TDC (IC8.96 R46.1 R49.2)
TDC_STOP1_P: clock_generator (IC4.53), TDC (IC8.97 R47.1 R48.2)
TDC_STOP2_N: clock_generator (IC4.42), TDC (IC8.83 R59.1 R62.2)
TDC_STOP2_P: clock_generator (IC4.43), TDC (IC8.84 R60.1 R61.2)
termination: FMC_Delay_1ns_4Cha (R41.1), INPUT_LOGIC (T3.1)
TRIG_OUT_LVTTL: FMC connector (J6.h17), INPUT_LOGIC (R109.2)
TRIG_SEL: FMC_Delay_1ns_4Cha (R107.2 SW1.2), INPUT_LOGIC (IC17.9)